# EAGLE design 001-top (EAGLE 9.6.2)

## Sheet 1 of 2
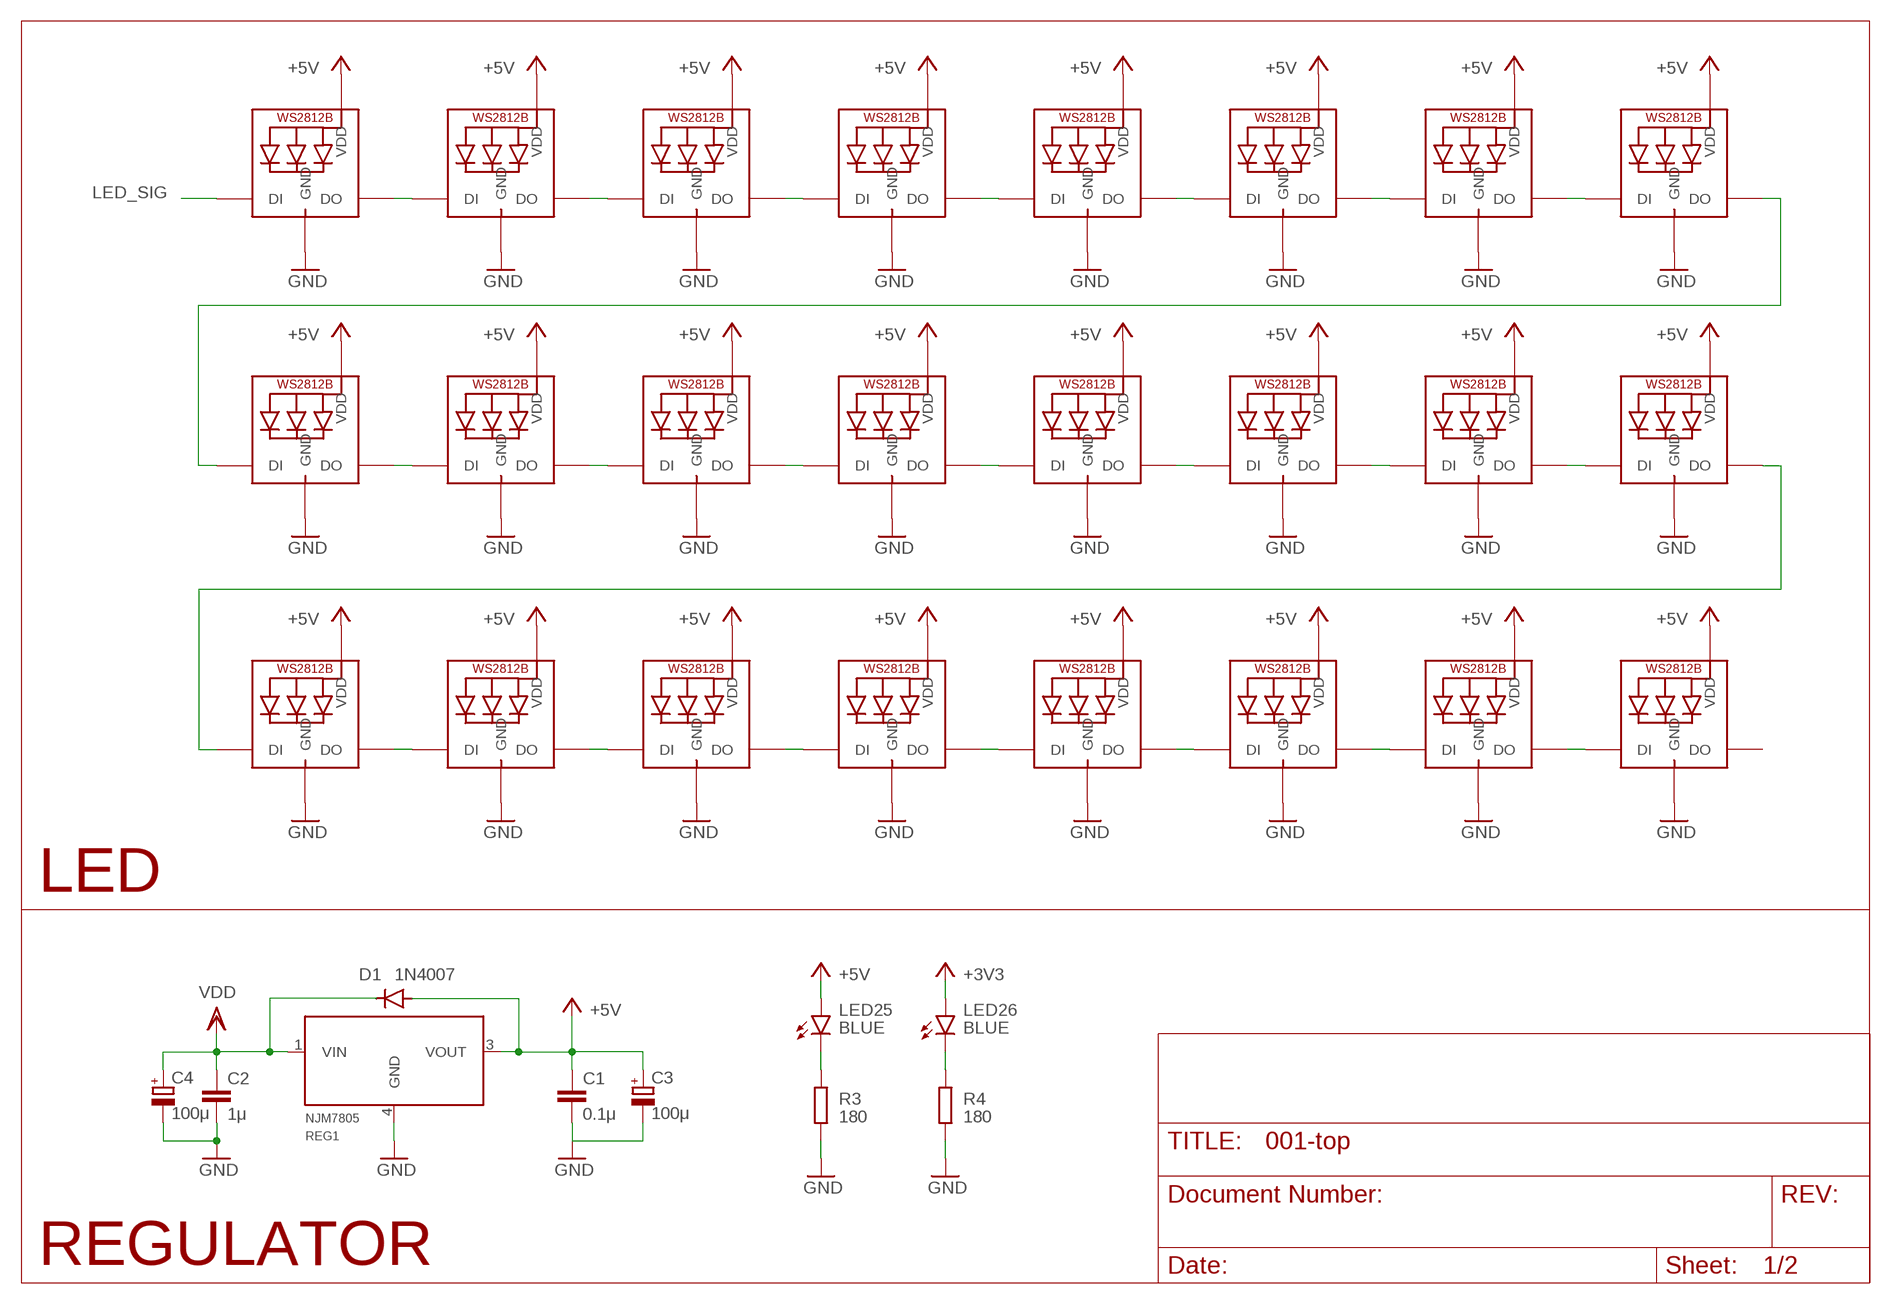
[diagram p0: schematic, sheet 1]

### Parts
C1  0.1μ  C-EUC0402  [C0402]
C2  1μ  C-EUC0402  [C0402]
C3  100μ  CPOL-EU153CLV-0505  [153CLV-0505]
C4  100μ  CPOL-EU153CLV-0505  [153CLV-0505]
D1  1N4007  GF1  [SMA-DO214AC]
LED1  WS2812B_5050N  [WS2812B-NARROW]
LED2  WS2812B_5050N  [WS2812B-NARROW]
LED3  WS2812B_5050N  [WS2812B-NARROW]
LED4  WS2812B_5050N  [WS2812B-NARROW]
LED5  WS2812B_5050N  [WS2812B-NARROW]
LED6  WS2812B_5050N  [WS2812B-NARROW]
LED7  WS2812B_5050N  [WS2812B-NARROW]
LED8  WS2812B_5050N  [WS2812B-NARROW]
LED9  WS2812B_5050N  [WS2812B-NARROW]
LED10  WS2812B_5050N  [WS2812B-NARROW]
LED11  WS2812B_5050N  [WS2812B-NARROW]
LED12  WS2812B_5050N  [WS2812B-NARROW]
LED13  WS2812B_5050N  [WS2812B-NARROW]
LED14  WS2812B_5050N  [WS2812B-NARROW]
LED15  WS2812B_5050N  [WS2812B-NARROW]
LED16  WS2812B_5050N  [WS2812B-NARROW]
LED17  WS2812B_5050N  [WS2812B-NARROW]
LED18  WS2812B_5050N  [WS2812B-NARROW]
LED19  WS2812B_5050N  [WS2812B-NARROW]
LED20  WS2812B_5050N  [WS2812B-NARROW]
LED21  WS2812B_5050N  [WS2812B-NARROW]
LED22  WS2812B_5050N  [WS2812B-NARROW]
LED23  WS2812B_5050N  [WS2812B-NARROW]
LED24  WS2812B_5050N  [WS2812B-NARROW]
LED25  BLUE  LEDSML0603  [SML0603]
LED26  BLUE  LEDSML0603  [SML0603]
R3  180  R-EU_R0402  [R0402]
R4  180  R-EU_R0402  [R0402]
REG1  NJM7805  MYPARTS_NJM7800S-REGULATOR  [MYPARTS_D-PAK_TO252AA]

### Nets
+3V3 [PWR]: LED26.A ; also sheet 2
+5V [PWR]: C1.1 C3.+ D1.A LED1.1-VDD(VDD) LED2.1-VDD(VDD) LED3.1-VDD(VDD) LED4.1-VDD(VDD) LED5.1-VDD(VDD) LED6.1-VDD(VDD) LED7.1-VDD(VDD) LED8.1-VDD(VDD) LED9.1-VDD(VDD) LED10.1-VDD(VDD) LED11.1-VDD(VDD) LED12.1-VDD(VDD) LED13.1-VDD(VDD) LED14.1-VDD(VDD) LED15.1-VDD(VDD) LED16.1-VDD(VDD) LED17.1-VDD(VDD) LED18.1-VDD(VDD) LED19.1-VDD(VDD) LED20.1-VDD(VDD) LED21.1-VDD(VDD) LED22.1-VDD(VDD) LED23.1-VDD(VDD) LED24.1-VDD(VDD) LED25.A REG1.3(VOUT) ; also sheet 2
GND [PWR]: C1.2 C2.2 C3.- C4.- LED1.3-GND(GND) LED2.3-GND(GND) LED3.3-GND(GND) LED4.3-GND(GND) LED5.3-GND(GND) LED6.3-GND(GND) LED7.3-GND(GND) LED8.3-GND(GND) LED9.3-GND(GND) LED10.3-GND(GND) LED11.3-GND(GND) LED12.3-GND(GND) LED13.3-GND(GND) LED14.3-GND(GND) LED15.3-GND(GND) LED16.3-GND(GND) LED17.3-GND(GND) LED18.3-GND(GND) LED19.3-GND(GND) LED20.3-GND(GND) LED21.3-GND(GND) LED22.3-GND(GND) LED23.3-GND(GND) LED24.3-GND(GND) R3.2 R4.2 REG1.4(GND) ; also sheet 2
LED_SIG: LED1.4-DIN(DI) ; also sheet 2
LED_SIGNAL1: LED8.2-DOUT(DO) LED9.4-DIN(DI)
N$1: LED1.2-DOUT(DO) LED2.4-DIN(DI)
N$2: LED2.2-DOUT(DO) LED3.4-DIN(DI)
N$3: LED3.2-DOUT(DO) LED4.4-DIN(DI)
N$4: LED4.2-DOUT(DO) LED5.4-DIN(DI)
N$5: LED5.2-DOUT(DO) LED6.4-DIN(DI)
N$6: LED6.2-DOUT(DO) LED7.4-DIN(DI)
N$7: LED7.2-DOUT(DO) LED8.4-DIN(DI)
N$8: LED9.2-DOUT(DO) LED10.4-DIN(DI)
N$9: LED10.2-DOUT(DO) LED11.4-DIN(DI)
N$10: LED11.2-DOUT(DO) LED12.4-DIN(DI)
N$11: LED12.2-DOUT(DO) LED13.4-DIN(DI)
N$12: LED13.2-DOUT(DO) LED14.4-DIN(DI)
N$13: LED14.2-DOUT(DO) LED15.4-DIN(DI)
N$14: LED15.2-DOUT(DO) LED16.4-DIN(DI)
N$15: LED17.2-DOUT(DO) LED18.4-DIN(DI)
N$16: LED18.2-DOUT(DO) LED19.4-DIN(DI)
N$17: LED19.2-DOUT(DO) LED20.4-DIN(DI)
N$18: LED20.2-DOUT(DO) LED21.4-DIN(DI)
N$19: LED21.2-DOUT(DO) LED22.4-DIN(DI)
N$20: LED22.2-DOUT(DO) LED23.4-DIN(DI)
N$21: LED23.2-DOUT(DO) LED24.4-DIN(DI)
N$22: LED16.2-DOUT(DO) LED17.4-DIN(DI)
N$23: LED25.C R3.1
N$24: LED26.C R4.1
VDD [PWR]: C2.1 C4.+ D1.K(C) REG1.1(VIN) ; also sheet 2
Unconnected: LED24.2-DOUT(DO)

### Notes on the sheet
- LED
- REGULATOR

## Sheet 2 of 2
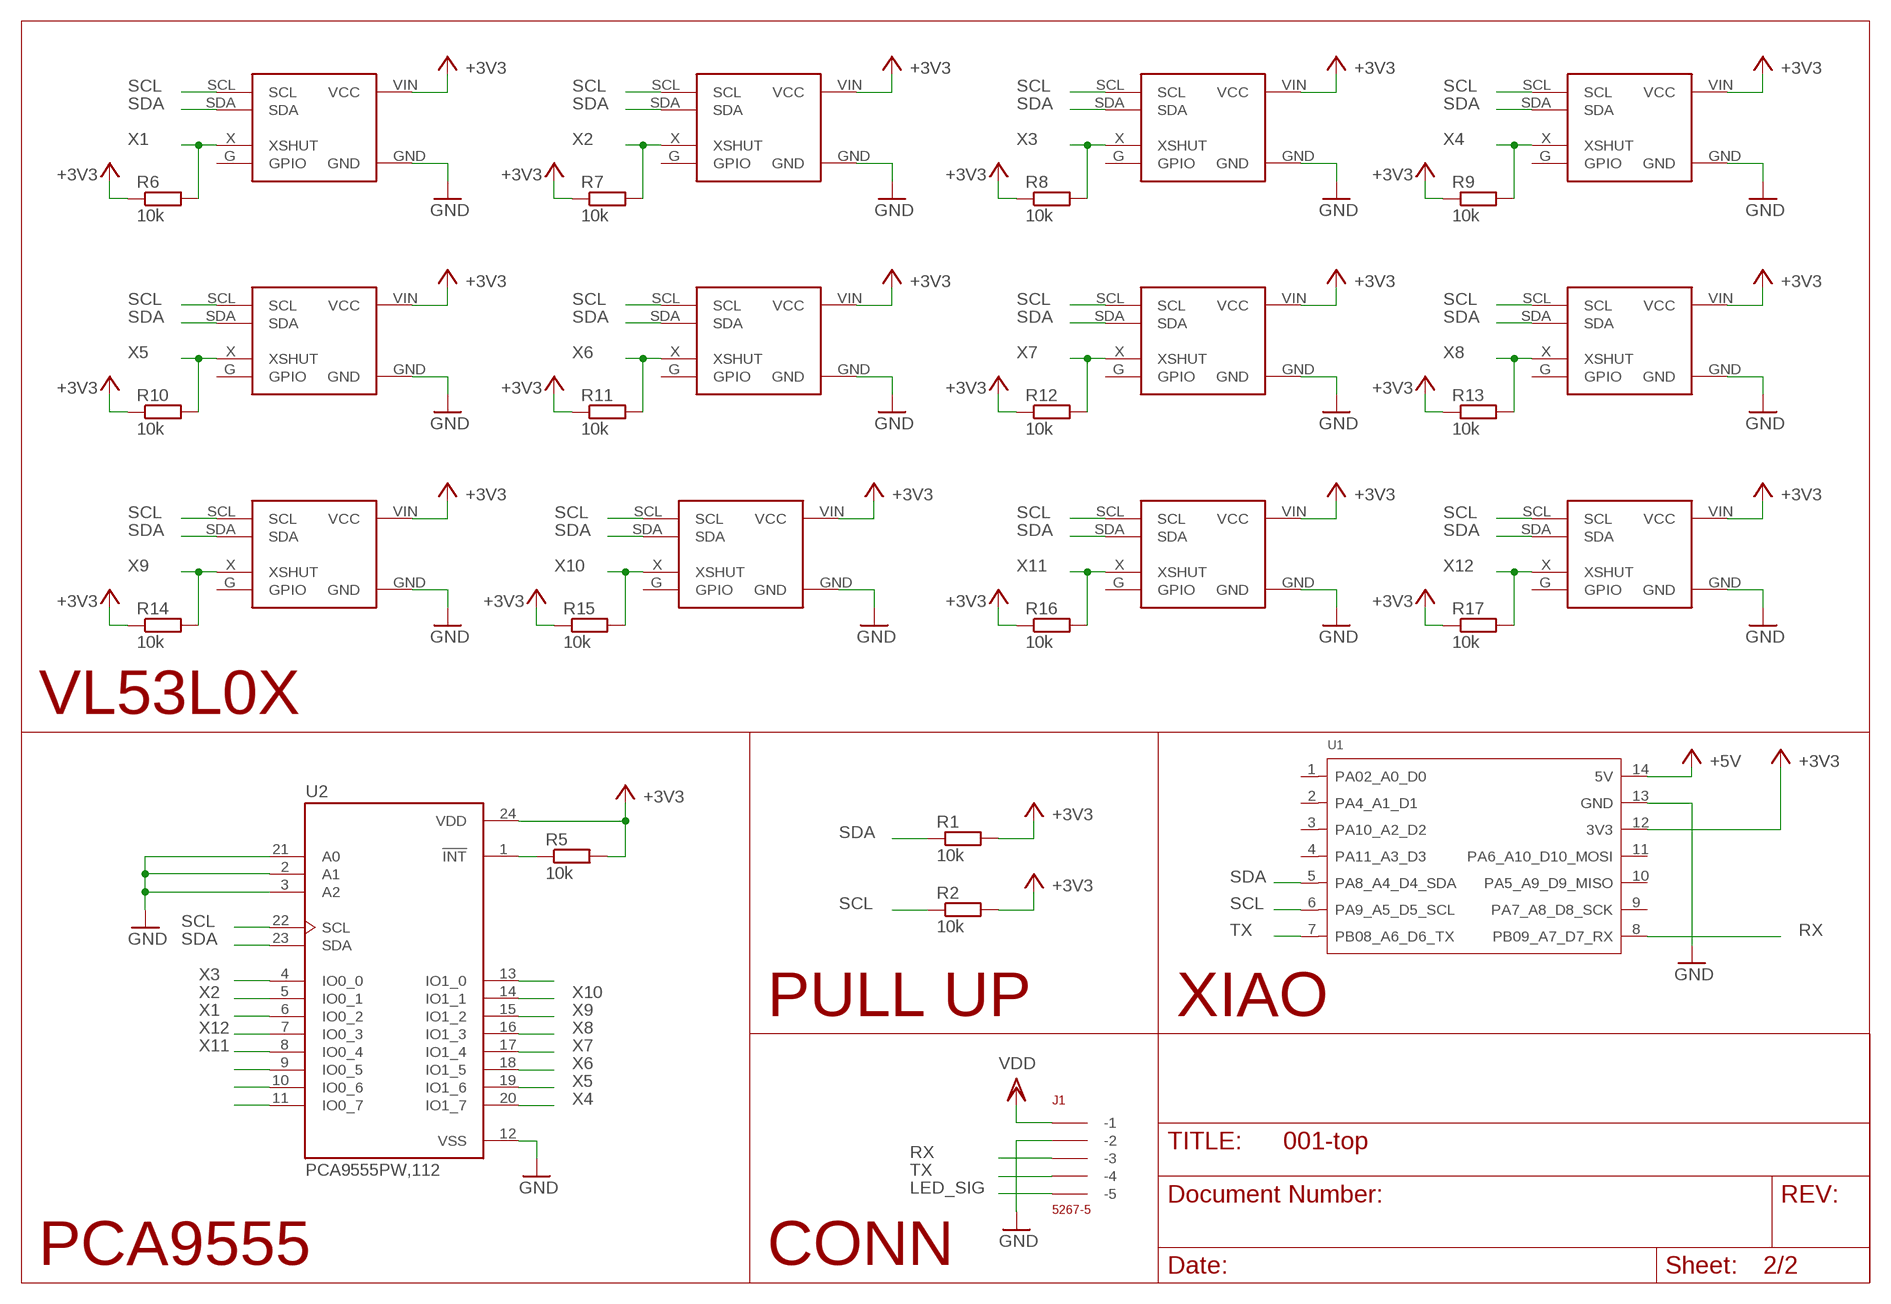
[diagram p1: schematic, sheet 2]

### Parts
J1  5267-5  [5267-5]
R1  10k  R-EU_R0402  [R0402]
R2  10k  R-EU_R0402  [R0402]
R5  10k  R-EU_R0402  [R0402]
R6  10k  R-EU_R0402  [R0402]
R7  10k  R-EU_R0402  [R0402]
R8  10k  R-EU_R0402  [R0402]
R9  10k  R-EU_R0402  [R0402]
R10  10k  R-EU_R0402  [R0402]
R11  10k  R-EU_R0402  [R0402]
R12  10k  R-EU_R0402  [R0402]
R13  10k  R-EU_R0402  [R0402]
R14  10k  R-EU_R0402  [R0402]
R15  10k  R-EU_R0402  [R0402]
R16  10k  R-EU_R0402  [R0402]
R17  10k  R-EU_R0402  [R0402]
U1  MOUDLE-SEEEDUINO-XIAO  [MOUDLE14P-2.54-21X17.8MM]
U2  PCA9555PW,112  [SOP65P640X110-24N]
VL1  VL53L0X  [1X04]
VL2  VL53L0X  [1X04]
VL3  VL53L0X  [1X04]
VL4  VL53L0X  [1X04]
VL5  VL53L0X  [1X04]
VL6  VL53L0X  [1X04]
VL7  VL53L0X  [1X04]
VL8  VL53L0X  [1X04]
VL9  VL53L0X  [1X04]
VL10  VL53L0X  [1X04]
VL11  VL53L0X  [1X04]
VL12  VL53L0X  [1X04]

### Nets
+3V3 [PWR]: R1.2 R2.2 R5.2 R6.1 R7.1 R8.1 R9.1 R10.1 R11.1 R12.1 R13.1 R14.1 R15.1 R16.1 R17.1 U1.12(3V3) U2.24(VDD) VL1.VIN(VCC) VL2.VIN(VCC) VL3.VIN(VCC) VL4.VIN(VCC) VL5.VIN(VCC) VL6.VIN(VCC) VL7.VIN(VCC) VL8.VIN(VCC) VL9.VIN(VCC) VL10.VIN(VCC) VL11.VIN(VCC) VL12.VIN(VCC) ; also sheet 1
+5V [PWR]: U1.14(5V) ; also sheet 1
GND [PWR]: J1.P$2(-2) U1.13(GND) U2.2(A1) U2.3(A2) U2.12(VSS) U2.21(A0) VL1.GND VL2.GND VL3.GND VL4.GND VL5.GND VL6.GND VL7.GND VL8.GND VL9.GND VL10.GND VL11.GND VL12.GND ; also sheet 1
LED_SIG: J1.P$5(-5) ; also sheet 1
N$25: R5.1 U2.1(!INT)
N$39: U2.9(IO0_5)
N$40: U2.10(IO0_6)
N$41: U2.11(IO0_7)
RX: J1.P$3(-3) U1.8(PB09_A7_D7_RX)
SCL: R2.1 U1.6(PA9_A5_D5_SCL) U2.22(SCL) VL1.SCL VL2.SCL VL3.SCL VL4.SCL VL5.SCL VL6.SCL VL7.SCL VL8.SCL VL9.SCL VL10.SCL VL11.SCL VL12.SCL
SDA: R1.1 U1.5(PA8_A4_D4_SDA) U2.23(SDA) VL1.SDA VL2.SDA VL3.SDA VL4.SDA VL5.SDA VL6.SDA VL7.SDA VL8.SDA VL9.SDA VL10.SDA VL11.SDA VL12.SDA
TX: J1.P$4(-4) U1.7(PB08_A6_D6_TX)
VDD [PWR]: J1.P$1(-1) ; also sheet 1
X1 [XSHUT]: R6.2 U2.6(IO0_2) VL1.X(XSHUT)
X2 [XSHUT]: R7.2 U2.5(IO0_1) VL2.X(XSHUT)
X3 [XSHUT]: R8.2 U2.4(IO0_0) VL3.X(XSHUT)
X4 [XSHUT]: R9.2 U2.20(IO1_7) VL4.X(XSHUT)
X4\: U2.13(IO1_0)
X5 [XSHUT]: R10.2 U2.19(IO1_6) VL5.X(XSHUT)
X6 [XSHUT]: R11.2 U2.18(IO1_5) VL6.X(XSHUT)
X7 [XSHUT]: R12.2 U2.17(IO1_4) VL7.X(XSHUT)
X8 [XSHUT]: R13.2 U2.16(IO1_3) VL8.X(XSHUT)
X9 [XSHUT]: R14.2 U2.15(IO1_2) VL9.X(XSHUT)
X10 [XSHUT]: R15.2 U2.14(IO1_1) VL10.X(XSHUT)
X11 [XSHUT]: R16.2 U2.8(IO0_4) VL11.X(XSHUT)
X12 [XSHUT]: R17.2 U2.7(IO0_3) VL12.X(XSHUT)
Unconnected: U1.1(PA02_A0_D0) U1.2(PA4_A1_D1) U1.3(PA10_A2_D2) U1.4(PA11_A3_D3) U1.9(PA7_A8_D8_SCK) U1.10(PA5_A9_D9_MISO) U1.11(PA6_A10_D10_MOSI) VL1.G(GPIO) VL2.G(GPIO) VL3.G(GPIO) VL4.G(GPIO) VL5.G(GPIO) VL6.G(GPIO) VL7.G(GPIO) VL8.G(GPIO) VL9.G(GPIO) VL10.G(GPIO) VL11.G(GPIO) VL12.G(GPIO)

### Notes on the sheet
- VL53L0X
- PULL UP | XIAO
- PCA9555 | CONN

## Library data of the parts
C1 C2 = rcl:C-EU: CAPACITOR, European symbol; SPICEPREFIX: C
C3 C4 = rcl:CPOL-EU: POLARIZED CAPACITOR, European symbol; SPICEPREFIX: C
D1 = diode:GF1: DIODE
J1 = con-molex-spox:5267-5
LED1-LED24 = microbuilder:WS2812B
LED25 LED26 = led:LED: LED OSRAM: - CHIPLED LG R971, LG N971, LY N971, LG Q971, LY Q971, LO R971, LY R971 LH N974, LH R974 LS Q976, LO Q976, LY Q976 LO Q996 - Hyper CHIPLED LW Q18S LB Q993, LB Q99A, LB R99A - SideLED LS A670, LO A670, LY A670, LG A670, LP A670 LB A673, LV A673, LT A673, LW A673 LH A674 LY A675 LS A676, LA A676, LO A676, LY A676, LW A676 LS A679, LY A679, LG A679 - Hyper Micro SIDELED® LS Y876, LA Y876, LO Y876, LY Y876 LT Y87S - SmartLED LW L88C, LW L88S LB L89C, LB L89S, LG L890 LS L89K, LO L89K, LY L89K LS L896, LA L896, LO L896, LY L896 - TOPLED LS T670, LO T670, LY T670, LG T670, LP T670 LSG T670, LSP T670, LSY T670, LOP T670, LYG T670 LG T671, LOG T671, LSG T671 LB T673, LV T673, LT T673, LW T673 LH T674 LS T676, LA T676, LO T676, LY T676, LB T676, LH T676, LSB T676, LW T676 LB T67C, LV T67C, LT T67C, LS T67K, LO T67K, LY T67K, LW E67C LS E67B, LA E67B, LO E67B, LY E67B, LB E67C, LV E67C, LT E67C LW T67C LS T679, LY T679, LG T679 LS T770, LO T770, LY T770, LG T770, LP T770 LB T773, LV T773, LT T773, LW T773 LH T774 LS E675, LA E675, LY E675, LS T675 LS T776, LA T776, LO T776, LY T776, LB T776 LHGB T686 LT T68C, LB T68C - Hyper Mini TOPLED® LB M676 - Mini TOPLED Santana® LG M470 LS M47K, LO M47K, LY M47K Source: http://www.osram.convergy.de LUXEON: - LUMILED® LXK2-PW12-R00, LXK2-PW12-S00, LXK2-PW14-U00, LXK2-PW14-V00 LXK2-PM12-R00, LXK2-PM12-S00, LXK2-PM14-U00 LXK2-PE12-Q00, LXK2-PE12-R00, LXK2-PE12-S00, LXK2-PE14-T00, LXK2-PE14-U00 LXK2-PB12-K00, LXK2-PB12-L00, LXK2-PB12-M00, LXK2-PB14-N00, LXK2-PB14-P00, LXK2-PB14-Q00 LXK2-PR12-L00, LXK2-PR12-M00, LXK2-PR14-Q00, LXK2-PR14-R00 LXK2-PD12-Q00, LXK2-PD12-R00, LXK2-PD12-S00 LXK2-PH12-R00, LXK2-PH12-S00 LXK2-PL12-P00, LXK2-PL12-Q00, LXK2-PL12-R00 Source: www.luxeon.com KINGBRIGHT: KA-3528ASYC Source: www.kingbright.com
R1-R17 = rcl:R-EU_: RESISTOR, European symbol; SPICEPREFIX: R
REG1 = #001-line:MYPARTS_NJM7800S-REGULATOR
U1 = Seeeduino XIAO:MOUDLE-SEEEDUINO-XIAO
U2 = PCA9555PW_112:PCA9555PW,112: Check availability <https://pricing.snapeda.com/parts/PCA9555PW%2C112/NXP%20Semiconductors/view-part?ref=eda>; AVAILABILITY: In Stock; DESCRIPTION: Interface IC - I/O extensions NXP Semiconductors PCA9555PW, 112 POR I²C, SMBus 400 kHz TSSOP 24; MF: NXP Semiconductors; MP: PCA9555PW,112; PACKAGE: TSSOP-24 NXP Semiconductors; PRICE: None; PURCHASE-URL: https://pricing.snapeda.com/search/part/PCA9555PW,112/?ref=eda
VL1-VL12 = VL53L0X:VL53L0X

## Net classes
0 default: width 0.381 mm
1 PWR: width 0.508 mm
2 XSHUT: width 0.254 mm

## Board
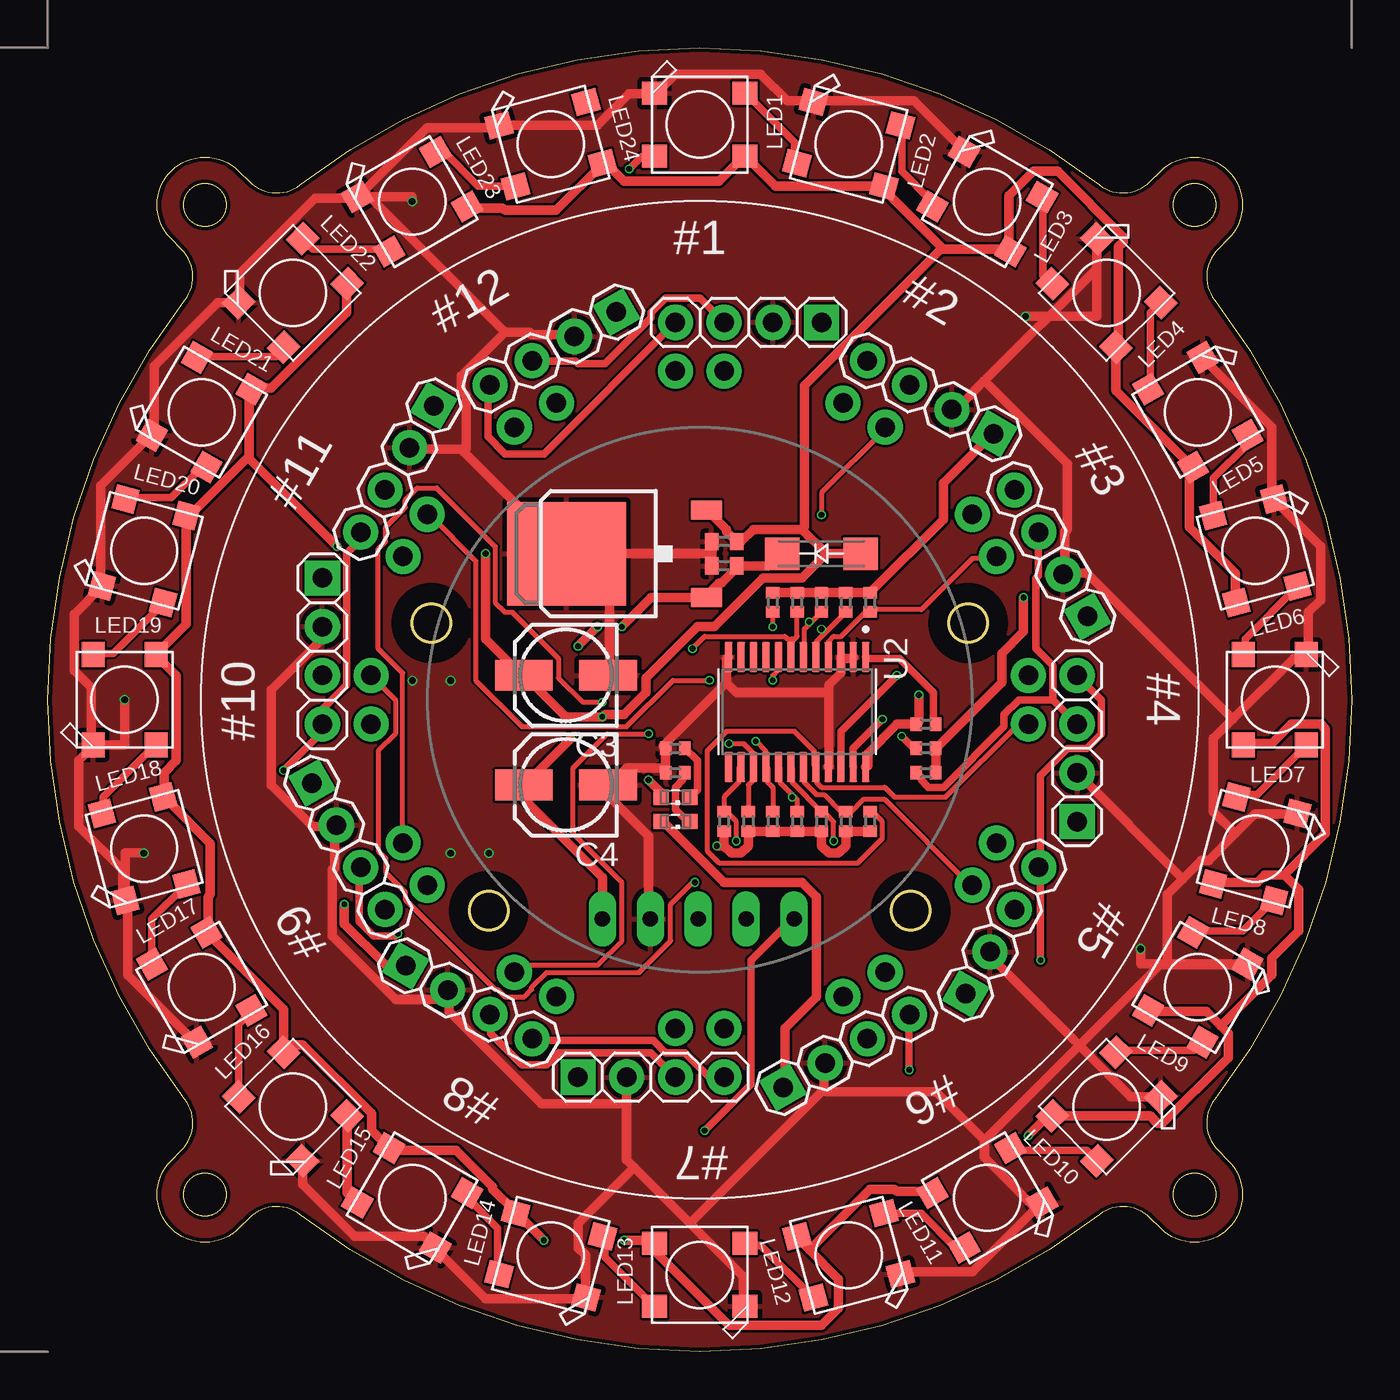
[diagram p2: board, top side]
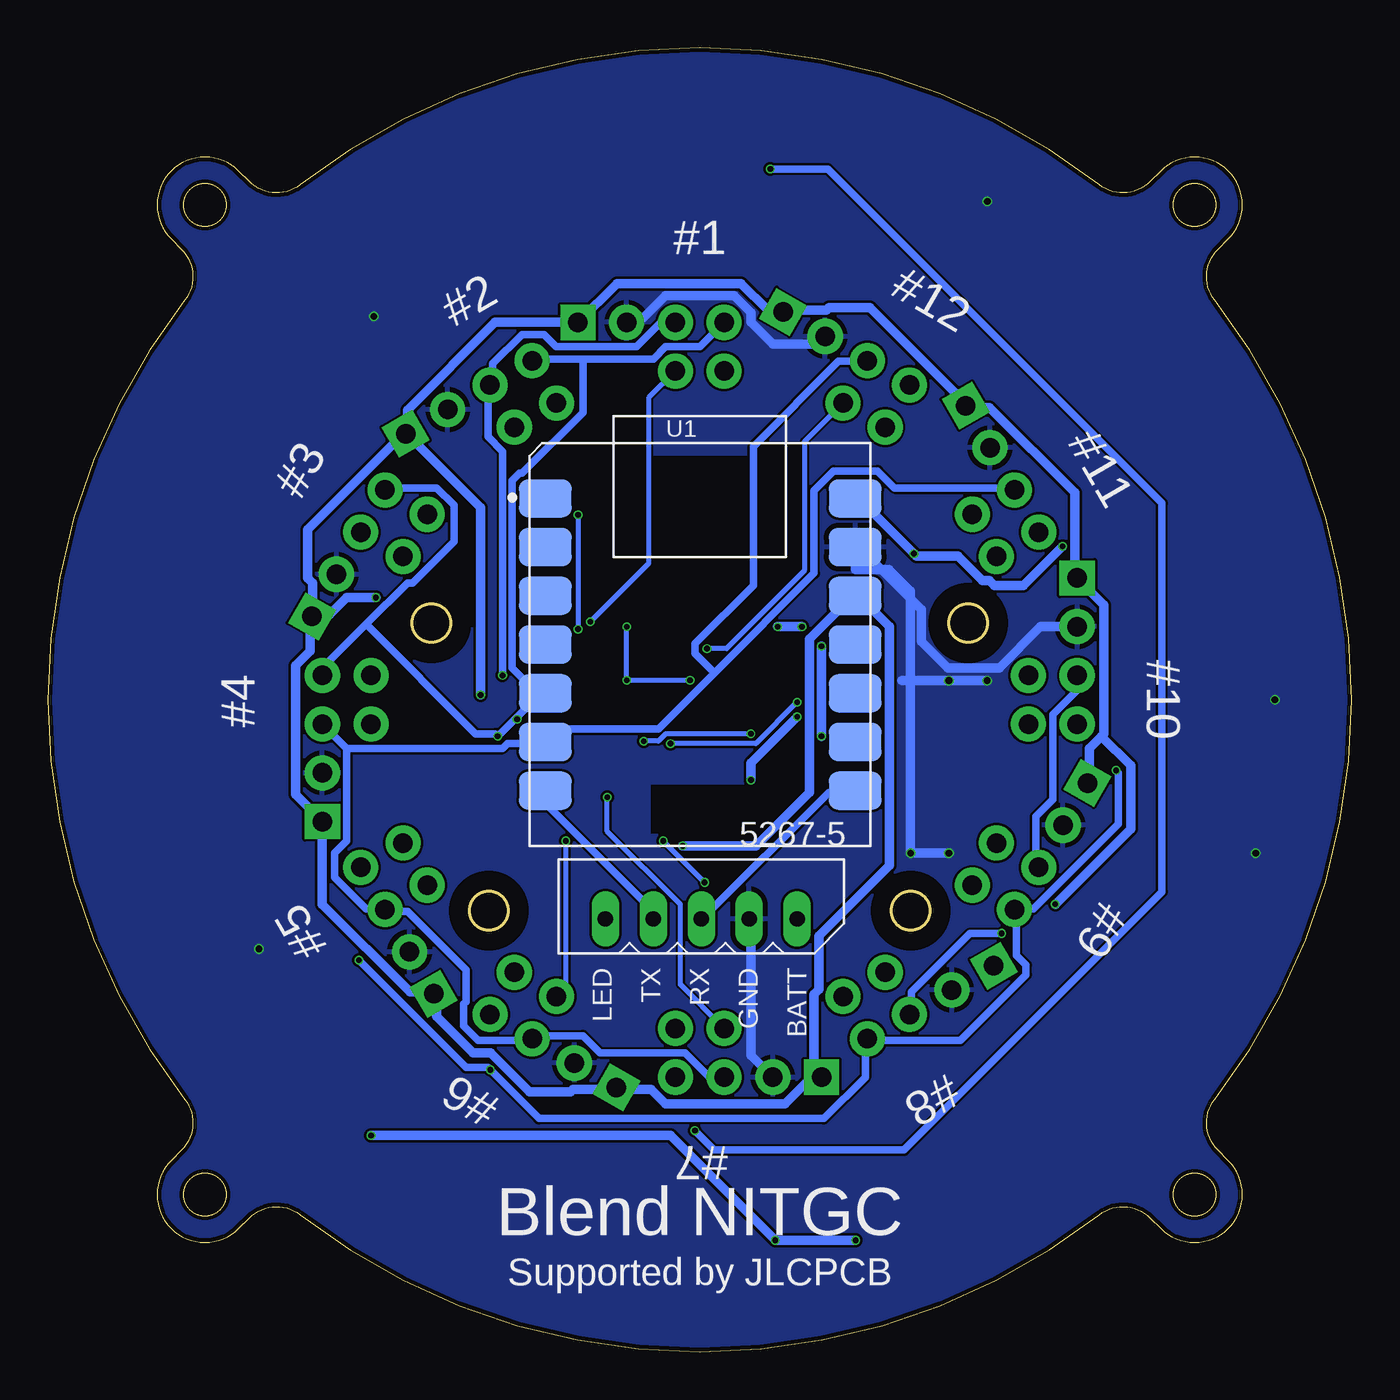
[diagram p3: board, bottom side, seen from below]

Size 68 x 68 mm. Coordinates in mm from the lower left corner, seen from the top.
Outline: 60.86,13.15 arc83 61.02,10.51 61.58,9.96 arc-180 58.04,6.42 57.49,6.98 arc83 54.85,7.14 arc-76 13.15,7.14 arc83 10.51,6.98 9.96,6.42 arc-180 6.42,9.96 6.98,10.51 arc83 7.14,13.15 arc-76 7.14,54.85 arc83 6.98,57.49 6.42,58.04 arc-180 9.96,61.58 10.51,61.02 arc83 13.15,60.86 arc-76 54.85,60.86 arc83 57.49,61.02 58.04,61.58 arc-180 61.58,58.04 61.02,57.49 arc83 60.86,54.85 arc-76 60.86,13.15
Outline: circle at 59.81,8.19 radius 1.1
Outline: circle at 59.81,59.81 radius 1.1
Outline: circle at 8.19,8.19 radius 1.1
Outline: circle at 8.19,59.81 radius 1.1
Outline: circle at 48,38 radius 1
Outline: circle at 45,23 radius 1
Outline: circle at 23,23 radius 1
Outline: circle at 20,38 radius 1
Copper layers (1*16): Top 0.035mm / dielectric 1.6mm / Bottom 0.035mm
Design rules "jlcpcb-2layers": minimum track width 5mil, minimum drill 0.3mm, track to track 5mil, track to pad 5mil, pad to pad 5mil, via to via 5mil, smd to smd 5mil, copper to edge 0.2mm, drill to drill 6mil, minimum pad ring 10mil, minimum via ring 3mil, stop-mask expansion 4mil, vias tented up to drill 0mil, thermal gap 10mil
tRestrict: area 43,21 to 47,25; area 21,21 to 25,25; area 46,36 to 50,40; area 18,36 to 22,40
bRestrict: area 21,21 to 25,25; area 43,21 to 47,25; area 46,36 to 50,40; area 18,36 to 22,40

### Footprints (pad centres in the part's own frame; a part is rotated, then mirrored left to right if it is on the bottom)
C0402 = smd 0.7 x 0.9: 1 -0.65,0; 2 0.65,0
153CLV-0505 = smd 3 x 1.6: + 2.2,0; - -2.2,0
SMA-DO214AC = smd 1.8 x 1.7: A -2.05,0; K 2.05,0
5267-5 = drill 0.8 long: P$1 0,0; P$2 2.5,0; P$3 5,0; P$4 7.5,0; P$5 10,0
WS2812B-NARROW = smd 1.3 x 1.2: 1-VDD 2.35,-1.65; 2-DOUT 2.35,1.65; 3-GND -2.35,1.65; 4-DIN -2.35,-1.65
SML0603 = smd 0.8 x 0.8: A 0.75,0; C -0.75,0
R0402 = smd 0.6 x 0.7: 1 -0.5,0; 2 0.5,0
MYPARTS_D-PAK_TO252AA = smd 1 x 1.6: 1 -2.28,-4.8; 3 2.28,-4.8 | smd 5.4 x 6.2: 4 0,2.5
MOUDLE14P-2.54-21X17.8MM = smd 2.75 x 2: 1 0.835,18.12; 2 0.835,15.58; 3 0.835,13.04; 4 0.835,10.5; 5 0.835,7.96; 6 0.835,5.42; 7 0.835,2.88; 8 17,2.88; 9 17,5.42; 10 17,7.96; 11 17,10.5; 12 17,13.04; 13 17,15.58; 14 17,18.12
SOP65P640X110-24N = smd 1.57 x 0.41: 1 -2.87,3.575; 2 -2.87,2.925; 3 -2.87,2.275; 4 -2.87,1.625; 5 -2.87,0.975; 6 -2.87,0.325; 7 -2.87,-0.325; 8 -2.87,-0.975; 9 -2.87,-1.625; 10 -2.87,-2.275; 11 -2.87,-2.925; 12 -2.87,-3.575; 13 2.87,-3.575; 14 2.87,-2.925; 15 2.87,-2.275; 16 2.87,-1.625; 17 2.87,-0.975; 18 2.87,-0.325; 19 2.87,0.325; 20 2.87,0.975; 21 2.87,1.625; 22 2.87,2.275; 23 2.87,2.925; 24 2.87,3.575
1X04 = drill 1.016: G -1.27,-2.54; GND 3.81,0; SCL 1.27,0; SDA -1.27,0; X 1.27,-2.54 | drill 1.016 square: VIN 6.35,0

### Placement (x,y rotation side)
C1  35.27,42.26 180 top
C2  35.27,40.99 180 top
C3  27.02,35.27 180 top
C4  27.02,29.56 180 top
D1  40.35,41.62 180 top
J1  28.92,22.57 180 bottom
LED1  34,64 0 top
LED2  41.76,62.98 345 top
LED3  49,59.98 330 top
LED4  55.21,55.21 315 top
LED5  59.98,49 300 top
LED6  62.98,41.76 285 top
LED7  64,34 270 top
LED8  62.98,26.24 255 top
LED9  59.98,19 240 top
LED10  55.21,12.79 225 top
LED11  49,8.02 210 top
LED12  41.76,5.02 195 top
LED13  34,4 180 top
LED14  26.24,5.02 165 top
LED15  19,8.02 150 top
LED16  12.79,12.79 135 top
LED17  8.02,19 120 top
LED18  5.02,26.24 105 top
LED19  4,34 90 top
LED20  5.02,41.76 75 top
LED21  8.02,49 60 top
LED22  12.79,55.21 45 top
LED23  19,59.98 30 top
LED24  26.24,62.98 15 top
LED25  32.73,28.92 180 top
LED26  32.73,27.65 180 top
R1  45.8,31.46 0 top
R2  45.8,30.19 0 top
R3  32.73,31.46 180 top
R4  32.73,30.19 180 top
R5  45.8,32.73 180 top
R6  40.35,39.08 270 top
R7  41.62,39.08 270 top
R8  42.89,39.08 270 top
R9  42.89,27.65 90 top
R10  41.62,27.65 90 top
R11  40.35,27.65 90 top
R12  39.08,27.65 90 top
R13  37.81,27.65 90 top
R14  36.54,27.65 90 top
R15  35.27,27.65 90 top
R16  37.81,39.08 270 top
R17  39.08,39.08 270 top
REG1  29.56,41.62 90 top
U1  42.89,26.38 0 bottom
U2  39.08,33.37 270 top
VL1  34,53.69 0 top
VL2  43.84,51.05 330 top
VL3  51.05,43.84 300 top
VL4  53.69,34 270 top
VL5  51.05,24.16 240 top
VL6  43.84,16.95 210 top
VL7  34,14.32 180 top
VL8  24.16,16.95 150 top
VL9  16.95,24.16 120 top
VL10  14.32,34 90 top
VL11  16.95,43.84 60 top
VL12  24.16,51.05 30 top

### Tracks (layer width: path | path; a pad name or v marks a point on that pad's centre or on a via)
+3V3  (via drill 0.3)
  Top 0.508: v15.46,23.33 15.46,22.32 17.62,20.16 18.63,20.16 VL8.VIN | LED26.A 32.1,27.65 35.27,24.48 39.33,24.48 40.1,23.71 40.1,18.51 38.45,16.86 38.45,13.81 VL6.VIN | R9.1 R10.1 41.62,26.38 41.24,26 40.73,26 40.35,26.38 R11.1 39.21,27.14 R12.1 37.94,27.14 R13.1 36.67,27.14 R14.1 36.54,26.38 36.16,26 35.65,26 35.27,26.38 | 35.27,26.38 R15.1 | v34.89,26.38 35.27,26.38 | R2.2 46.32,30.19 46.32,31.46 R1.2 46.45,31.59 49.75,34.89 49.75,36.41 50.89,37.56 v50.89,39.33 | U2.24 42.76,30.57 42.76,31.21 44.29,32.73 R5.2 45.43,32.86 v45.43,34.25 | R16.1 R17.1 39.21,39.59 R6.1 40.48,39.59 R7.1 41.75,39.59 R8.1 43.02,39.72 46.7,43.4 46.7,45.3 49.24,47.84 VL2.VIN
  Bottom 0.508: 13.05,32.1 12.92,32.22 12.92,38.95 VL10.VIN 14.44,40.48 14.44,44.8 18.89,49.24 20.03,49.24 VL11.VIN 20.16,49.49 25.11,54.45 27.27,54.45 27.4,54.32 29.56,54.32 VL12.VIN 29.81,54.32 30.44,54.32 31.84,55.72 38.32,55.72 VL1.VIN 44.67,53.69 49.24,49.11 49.24,48.1 VL2.VIN | 13.05,32.1 13.68,31.46 13.68,29.68 VL9.VIN | v15.46,23.33 11.52,27.27 11.52,30.57 13.05,32.1 | v34.89,26.38 31.08,26.38 28.29,29.17 28.29,37.18 26.13,39.33 U1.12 25.87,39.33 25.62,39.33 24.09,37.81 24.09,25.36 27.78,21.68 27.78,18.89 28.03,18.63 28.03,14.7 VL7.VIN 28.03,14.44 29.56,12.92 35.78,12.92 36.54,13.68 38.32,13.68 VL6.VIN 38.57,13.68 40.6,13.68 40.73,13.55 42.89,13.55 44.92,15.59 45.81,15.59 47.72,17.49 47.72,18.51 VL5.VIN 47.97,18.76 49.11,18.76 53.69,23.33 VL4.VIN 55.08,29.05 55.08,35.78 54.32,36.54 54.32,38.19 VL3.VIN | v50.89,39.33 52.42,39.33 53.3,38.45 54.19,38.45 VL3.VIN | v45.43,34.25 45.43,44.03 49.24,47.84 VL2.VIN | VL3.VIN 54.19,38.7 54.19,40.1 54.45,40.35 54.45,42.89 49.49,47.84 VL2.VIN
+5V  (via drill 0.3)
  Top 0.508: REG1.3 34.38,43.91 35.4,42.89 35.4,42.76 35.91,42.26 C1.1 36.16,42.26 36.79,42.89 39.33,42.89 | 40.6,41.62 D1.A | 39.33,42.89 40.6,41.62 | v31.33,29.81 31.97,29.17 31.97,28.92 LED25.A | v22.82,41.62 22.82,37.18 24.6,35.4 C3.+ 24.86,35.27 27.02,33.11 v28.92,33.11 29.05,33.24 30.06,33.24 31.21,34.38 31.21,35.14 33.87,37.81 34.76,37.81 37.3,40.35 39.33,40.35 40.6,41.62 | LED6.1-VDD 61.94,39.08 61.94,40.6 59.53,43.02 59.53,46.07 LED5.1-VDD 59.65,46.19 55.72,50.13 55.72,52.29 LED4.1-VDD 55.84,52.54 55.84,57.62 56.1,57.88 56.1,58.13 52.67,61.56 51.4,61.56 50.13,60.29 50.13,57.75 LED3.1-VDD 50.13,57.5 46.7,57.5 | LED23.1-VDD 21.94,59.65 23.71,59.65 23.84,59.53 26.51,59.53 28.92,61.94 LED24.1-VDD 29.17,61.94 30.06,61.05 35.02,61.05 36.16,62.19 LED1.1-VDD 36.41,62.32 37.94,60.8 43.53,60.8 LED2.1-VDD 43.65,60.54 46.7,57.5 | 39.33,42.89 39.46,43.02 39.46,50.38 46.57,57.5 46.7,57.5 | 61.18,16.98 60.42,17.74 57.5,17.74 LED9.1-VDD | 61.18,16.98 61.56,16.6 61.56,15.33 58.13,11.9 57.88,11.9 57.5,12.28 52.42,12.28 LED10.1-VDD 52.16,12.28 v51.15,11.27 | 64.48,24.86 63.46,24.86 63.08,24.48 60.8,24.48 LED8.1-VDD | 64.48,24.86 65.24,24.09 65.24,21.94 63.85,20.54 63.85,19.65 61.18,16.98 | 64.48,24.86 66.64,27.02 66.64,32.48 66.39,32.73 64.86,32.73 63.85,31.71 62.45,31.71 LED7.1-VDD | 39.72,5.3 39.08,5.93 LED12.1-VDD | 39.72,5.3 41.24,3.77 41.24,2.25 40.35,1.36 35.52,1.36 31.71,5.17 31.71,5.55 LED13.1-VDD 31.46,5.81 v30.06,5.81 | 39.72,5.3 42.89,8.47 44.16,8.47 44.29,8.35 46.07,8.35 LED11.1-VDD | 10.51,46.7 10.51,50.13 LED21.1-VDD 10.89,50.26 11.65,50.26 15.59,54.19 15.59,55.59 LED22.1-VDD
  Top 0.508: 10.51,46.7 7.46,43.65 LED20.1-VDD 7.2,43.53 7.2,37.94 5.81,36.54 LED19.1-VDD 5.68,36.29 6.7,35.27 6.7,30.83 6.06,30.19 6.06,29.05 LED18.1-VDD 6.19,28.79 8.47,26.51 8.47,23.84 8.35,23.71 8.35,21.94 LED17.1-VDD 12.29,17.84 12.29,16 | v25.87,5.81 24.6,7.08 LED14.1-VDD 24.35,7.33 23.21,8.47 23.21,8.6 21.3,10.51 18,10.51 LED15.1-VDD 16.88,11.53 16.88,12.41 13.29,16 12.29,16 | v15.08,42 10.51,46.57 10.51,46.7 | LED16.1-VDD 12.29,16
  Bottom 0.508: v31.33,29.81 31.33,30.7 v28.92,33.11 | U1.14 25.87,44.41 25.62,44.41 v22.82,41.62 22.7,41.49 20.54,41.49 19.27,40.22 18.89,40.22 18.63,39.97 17.11,39.97 v15.08,42 | v25.87,5.81 v30.06,5.81 35.52,11.27 v51.15,11.27
GND  (via drill 0.35)
  Top 0.508: 34.64,41.62 34.64,42.26 C1.2 | 34.64,41.62 34.64,40.99 C2.2 | REG1.4 34.64,41.62 | C3.- 29.3,35.27 29.3,41.49 REG1.4 | 21.68,46.95 26.89,41.75 REG1.4 | 21.68,46.95 21.55,47.08 18.89,47.08 VL11.GND | 23.84,53.18 25.11,53.18 25.24,53.05 27.4,53.05 VL12.GND | 23.84,53.18 21.55,50.89 21.55,50.13 21.81,49.88 21.81,47.08 21.68,46.95 | LED3.3-GND 47.72,62.7 45.18,65.24 39.97,65.24 LED2.3-GND 39.72,65.24 38.57,65.24 37.18,66.64 32.73,66.64 31.84,65.75 LED1.3-GND 31.59,65.62 30.32,65.62 28.67,63.97 23.71,63.97 LED24.3-GND 23.46,63.85 19.78,63.85 16.22,60.29 LED23.3-GND | 7.84,16.09 LED17.3-GND 7.58,16.22 4.16,19.65 4.16,23.46 LED18.3-GND | LED19.3-GND 2.25,31.71 2.25,34.64 1.36,35.52 1.36,38.45 2.76,39.84 LED20.3-GND 2.76,40.1 2.76,45.18 5.3,47.72 LED21.3-GND 5.55,47.97 5.55,51.4 8.85,54.7 9.87,54.7 LED22.3-GND 10,54.96 10,56.23 13.93,60.16 15.97,60.16 LED23.3-GND | LED18.3-GND 3.9,23.71 3.9,25.11 1.62,27.4 1.62,30.83 2.25,31.46 LED19.3-GND | 23.84,53.18 16.6,60.42 LED23.3-GND | 40.73,34.38 40.73,34.76 41.37,35.4 41.37,36.16 | 40.73,34.38 40.73,30.57 U2.21 | 41.37,36.16 U2.3 | 41.37,36.16 42,36.16 U2.2 | 35.4,34.89 35.4,36.16 U2.12 | 35.4,34.89 32.1,31.59 R3.2 R4.2 32.1,30.44 30.19,30.44 29.3,29.56 C4.- 29.43,29.43 29.43,28.79 31.33,26.89 31.33,22.57 J1.P$2 | 40.73,34.38 35.91,34.38 35.4,34.89 | 30.57,9.62 30.19,10 30.19,12.92 | 30.57,9.62 33.49,6.7 | 33.49,6.7 36.29,3.9 36.29,2.38 LED13.3-GND | VL7.GND 30.19,12.92 | 30.57,9.62 27.65,6.7 27.65,5.43 28.03,5.04 28.03,2.89 LED14.3-GND 27.9,2.76 22.82,2.76 20.28,5.3 LED15.3-GND 19.63,6 16,6 13.28,8.72 LED16.3-GND
  Top 0.508: 40.48,13.68 40.48,14.95 VL6.GND | 33.49,6.7 40.48,13.68 | 30.19,12.92 25.75,12.92 20.92,17.74 20.92,18.76 VL8.GND 20.79,18.38 18.13,18.38 14.82,21.68 14.82,25.11 14.95,25.24 14.95,27.4 VL9.GND 14.7,27.4 13.81,27.4 11.65,29.56 11.65,34.51 14.32,37.18 VL10.GND | 48.86,50.64 47.46,49.24 47.21,49.24 VL2.GND | 48.86,50.64 54.7,56.48 54.7,58 LED4.3-GND 54.72,54 v51,54 | 48.86,50.64 53.18,46.32 53.18,42.89 53.05,42.76 53.05,40.6 VL3.GND 53.3,40.6 54.19,40.6 61.81,32.98 | LED5.3-GND 60.29,51.78 63.85,48.22 63.85,44.54 LED6.3-GND 64.1,44.29 66.39,42 66.39,39.21 65.75,38.57 65.75,36.41 LED7.3-GND 65.5,36.16 64.99,36.16 61.81,32.98 | LED12.3-GND 44.54,4.16 48.22,4.16 51.78,7.71 LED11.3-GND 51.4,7.58 48.86,10.12 48.86,11.01 | 53.81,15.97 49.24,20.54 49.24,20.79 VL5.GND | 53.81,15.97 56.48,13.3 58,13.3 LED10.3-GND | 58.38,20.16 58,20.16 53.81,15.97 | 58.38,20.16 62.58,20.16 LED9.3-GND 57,20.21 v57,21 | 61.94,27.02 60.54,25.62 60.16,25.62 59.21,24.67 | 61.94,27.02 62.96,28.03 65.12,28.03 LED8.3-GND | 59.21,24.67 58.38,23.84 58.38,20.16 | 59.21,24.67 VL4.GND | 53.81,15.97 48.86,11.01 | 61.81,32.98 60.8,31.97 60.8,28.16 61.94,27.02 | 48.86,11.01 46.32,13.55 40.6,13.55 40.48,13.68 | LED23.3-GND 19,60.24 v19,60 | LED19.3-GND 4,31.65 v4,34 | LED18.3-GND 4.04,26 v5,26 | REG1.4 26.68,42 25,42
  Bottom 0.508: VL1.GND 37.18,53.69 35.78,55.08 32.22,55.08 31.33,54.19 31.33,53.69 30.19,52.54 27.9,52.54 27.52,52.92 VL12.GND | VL10.GND 16.22,37.81 18.38,35.65 21.05,35.65 22.44,37.05 22.44,38.7 25.62,41.87 25.87,41.87 U1.13 25.89,40.8 24.13,40.8 23,39.67 23,35 | VL7.GND 31.33,15.46 31.33,22.57 J1.P$2 | 23.46,35 23,35 | v19.01,35 v21,35 23,35 | 23,35 v23,26 v21,26
  pour Top: 0,68 68,68 68,0 0,0
  pour Bottom: 0,68 68,68 68,0 0,0
LED_SIG  (via drill 0.3)
  Top 0.381: v30.32,61.69 30.95,62.32 31.59,62.32 LED1.4-DIN | v34.25,11.52 36.67,13.93 36.67,20.41 38.83,22.57 J1.P$5
  Bottom 0.381: v30.32,61.69 27.32,61.69 9.89,44.26 9.89,23.98 23.35,10.52 33.25,10.52 v34.25,11.52
LED_SIGNAL1
  Top 0.381: LED9.4-DIN 59.78,21.94 62.32,21.94 63.85,23.46 LED8.2-DOUT
N$1
  Top 0.381: LED2.4-DIN 38.95,62.07 38.95,63.08 36.41,65.62 LED1.2-DOUT
N$2
  Top 0.381: LED2.2-DOUT 44.54,63.85 44.54,61.56 46.07,60.04 46.07,59.78 LED3.4-DIN
N$3
  Top 0.381: LED3.2-DOUT 51.91,60.16 51.91,56.1 52.29,55.72 LED4.4-DIN
N$4
  Top 0.381: LED5.4-DIN 57.5,50.26 57.5,54.19 58,54.7 LED4.2-DOUT
N$5
  Top 0.381: LED6.4-DIN 60.8,43.65 60.8,45.56 62.58,47.34 62.58,47.72 LED5.2-DOUT
N$6
  Top 0.381: LED7.4-DIN 62.45,36.41 62.45,37.18 65.12,39.84 LED6.2-DOUT
N$7
  Top 0.381: LED8.4-DIN 62.07,29.05 63.08,29.05 65.62,31.59 LED7.2-DOUT
N$8
  Top 0.381: LED10.4-DIN 55.72,15.71 59.78,15.71 60.16,16.09 LED9.2-DOUT
N$9
  Top 0.381: LED11.4-DIN 50.26,10.51 54.19,10.51 54.7,10 LED10.2-DOUT
N$10
  Top 0.381: LED12.4-DIN 43.65,7.2 45.56,7.2 47.34,5.43 47.72,5.43 LED11.2-DOUT
N$11
  Top 0.381: LED13.4-DIN 36.41,5.55 37.18,5.55 39.84,2.89 LED12.2-DOUT
N$12
  Top 0.381: LED14.4-DIN 29.05,5.93 29.05,4.92 31.59,2.38 LED13.2-DOUT
N$13
  Top 0.381: LED14.2-DOUT 23.46,4.16 23.46,6.44 21.94,7.97 21.94,8.22 LED15.4-DIN
N$14
  Top 0.508: LED15.2-DOUT 15.62,8.29 LED16.4-DIN
N$15
  Top 0.381: LED17.2-DOUT 5.43,20.28 5.43,22.57 7.2,24.35 LED18.4-DIN
N$16
  Top 0.381: LED18.2-DOUT 2.89,28.16 2.89,28.92 5.55,31.59 LED19.4-DIN
N$17
  Top 0.381: LED19.2-DOUT 2.38,36.41 3.39,36.41 5.93,38.95 LED20.4-DIN
N$18
  Top 0.381: LED20.2-DOUT 4.16,44.54 6.44,44.54 7.97,46.07 8.22,46.07 LED21.4-DIN
N$19
  Top 0.381: LED21.2-DOUT 7.84,51.91 11.9,51.91 12.28,52.29 LED22.4-DIN
N$20
  Top 0.381: LED23.4-DIN 17.74,57.5 13.81,57.5 13.3,58 LED22.2-DOUT
N$21
  Top 0.381: LED24.4-DIN 24.35,60.8 22.44,60.8 20.67,62.58 20.28,62.58 LED23.2-DOUT
N$22
  Top 0.381: LED17.4-DIN 10.63,17.74 9.96,17.07 LED16.2-DOUT
N$23
  Top 0.381: R3.1 33.87,30.83 33.87,29.3 33.49,28.92 LED25.C
N$24
  Top 0.381: R4.1 33.11,30.19 33.11,29.81 32.73,29.43 32.73,28.29 33.37,27.65 LED26.C
N$25
  Top 0.381: R5.1 46.19,32.73 46.19,34.38 44.41,36.16 42.76,36.16 U2.1
RX
  Bottom 0.381: U1.8 26,29.17 27.27,29.17 33.87,22.57 J1.P$3
SCL  (via drill 0.3)
  Top 0.381: VL7.SCL 31.46,15.59 26.63,15.59 26,14.95 24.73,14.95 23.08,16.6 23.08,17.49 VL8.SCL | v18.25,21.81 18.13,21.68 16.98,21.68 16.22,22.44 16.22,25.24 VL9.SCL | VL1.SCL 34,54.96 32.22,54.96 31.46,54.19 31.46,53.94 29.05,51.53 27.65,51.53 27.52,51.65 25.36,51.65 VL12.SCL | v44.29,35.27 41.37,32.35 41.37,30.57 U2.22 | 52.42,34 50.64,34 49.88,33.24 49.88,32.6 46.7,29.43 45.94,29.43 45.56,29.81 45.56,29.94 45.3,30.19 R2.1 | VL4.SCL 52.42,34 | 52.42,34 52.42,35.78 51.53,36.67 51.53,40.35 51.65,40.48 51.65,42.64 VL3.SCL
  Bottom 0.381: VL10.SCL 14.32,34.51 15.59,33.24 15.59,28.79 16.47,27.9 16.47,25.49 16.35,25.36 VL9.SCL | VL7.SCL 33.49,14.32 34.76,15.59 39.21,15.59 40.1,16.47 42.51,16.47 42.64,16.35 VL6.SCL 42.89,16.22 45.56,16.22 46.32,16.98 46.32,18.13 46.19,18.25 46.19,19.9 49.24,22.95 50.26,22.95 VL5.SCL 50.51,23.08 51.4,23.08 53.05,24.73 53.05,26 52.42,26.63 52.42,31.46 | v18.25,21.81 19.9,21.81 22.95,18.76 22.95,17.62 VL8.SCL | v44.29,35.27 44.29,46.95 45.05,47.72 45.05,50.38 VL2.SCL 44.8,50.51 44.8,51.53 43.27,53.05 42.13,53.05 41.49,52.42 37.3,52.42 36.03,53.69 VL1.SCL | 52.42,31.46 44.29,31.46 44.03,31.71 42.13,31.71 U1.6 41.87,31.84 41.24,32.48 36.16,32.48 33.24,35.4 | VL4.SCL 52.42,31.46 | 33.24,35.4 28.03,40.6 28.03,44.92 27.02,45.94 24.73,45.94 23.84,45.05 17.62,45.05 VL11.SCL | 33.24,35.4 34.25,36.41 34.25,36.92 31.21,39.97 31.21,47.21 26.76,51.65 25.36,51.65 VL12.SCL
SDA  (via drill 0.3)
  Top 0.381: VL11.SDA 16.22,42.64 16.22,42.26 15.59,41.62 15.59,34.76 14.32,33.49 VL10.SDA 14.19,32.6 14.19,32.22 v12.28,30.32 | VL7.SDA 34.51,14.32 33.24,15.59 32.22,15.59 31.59,16.22 25.36,16.22 VL8.SDA | v44.92,14.7 44.92,17.49 VL6.SDA | VL1.SDA 25.87,46.83 23.84,46.83 22.95,47.72 22.95,50.38 VL12.SDA | v44.54,32.1 45.18,31.46 R1.1 | v43.53,32.98 42,31.46 42,30.57 U2.23 | VL4.SDA 54.96,34 54.96,32.22 54.19,31.46 53.18,31.46 51.78,30.06 51.78,25.36 VL5.SDA 51.78,25.11 v51.78,20.41
  Bottom 0.381: v12.28,30.32 12.16,30.19 12.16,27.52 16.6,23.08 17.36,23.08 VL9.SDA 17.49,22.95 17.49,20.67 16.98,20.16 16.98,19.65 20.41,16.22 25.24,16.22 VL8.SDA 25.36,16.09 25.36,14.32 27.52,12.16 42.38,12.16 v44.92,14.7 45.05,14.82 46.19,14.82 v51.78,20.41 | 40.1,51.78 36.41,51.78 35.78,52.42 34,52.42 VL1.SDA | 40.1,51.78 42.64,51.78 VL2.SDA | 43.59,33.05 42.38,34.25 42.13,34.25 U1.5 42.51,34.38 43.78,35.65 43.78,45.43 43.4,45.81 43.27,45.81 40.1,48.99 40.1,51.78 | 43.59,33.05 v44.54,32.1 44.67,32.22 45.68,32.22 51.4,37.94 | v43.53,32.98 43.59,33.05 | 51.4,37.94 53.69,35.65 VL4.SDA | 51.4,37.94 49.24,40.1 48.99,40.1 46.83,42.26 46.83,44.16 47.72,45.05 50.38,45.05 VL3.SDA
TX
  Bottom 0.381: U1.7 42,29.17 42,28.54 36.54,23.08 36.54,22.57 J1.P$4
VDD  (via drill 0.3)
  Top 0.508: D1.K 38.19,41.62 37.56,40.99 C2.1 35.91,40.86 35.14,40.1 35.02,40.1 34.38,39.46 REG1.1 34.13,39.33 31.46,39.33 v29.94,37.81 | J1.P$1 28.92,24.73 24.86,28.79 24.86,29.56 C4.+ 24.98,29.68 27.4,32.1 v27.65,32.1 | v27.65,36.79 v28.67,37.81
  Bottom 0.508: v28.67,37.81 v29.94,37.81 | v27.65,32.1 v27.65,36.79
X1  (via drill 0.3)
  Top 0.254: 39.78,38 39.46,37.68 39.46,36.29 U2.6 | 39.78,38 R6.2 | v39.72,38.06 39.78,38
  Bottom 0.254: v39.72,38.06 36.67,41.11 36.67,49.75 VL1.X
X2  (via drill 0.3)
  Top 0.254: 40.54,37.49 40.1,37.05 40.1,36.29 U2.5 | 40.54,37.49 R7.2 | v40.35,37.68 40.54,37.49 | v40.35,43.65 40.35,44.8 43.65,48.1 VL2.X
  Bottom 0.254: v40.35,43.65 v40.35,37.68
X3
  Top 0.254: U2.4 40.73,36.29 40.73,37.05 40.99,37.3 41.37,37.3 42.64,38.57 R8.2 42.89,38.7 45.56,38.7 48.22,41.37 49.37,41.37 VL3.X
X4
  Top 0.254: R9.2 42.89,28.03 43.14,28.03 43.53,27.65 43.53,26.76 42.26,25.49 35.02,25.49 34.38,26.13 34.38,31.33 35.4,32.35 38.95,32.35 39.97,31.33 39.97,30.57 U2.20 40.1,30.44 40.1,29.68 40.35,29.43 43.65,29.43 44.16,28.92 46.83,28.92 50.64,32.73 VL4.X
X5
  Top 0.254: R10.2 41.37,28.16 40.48,29.05 40.1,29.05 39.46,29.68 39.46,30.44 U2.19 | R10.2 41.87,28.16 42.51,28.79 43.65,28.79 48.1,24.35 VL5.X | R10.2
X6  (via drill 0.3)
  Top 0.254: U2.18 38.83,30.44 38.83,29.68 R11.2 40.35,28.03 40.6,28.03 40.99,27.65 v40.99,26.63
  Bottom 0.254: v40.99,26.63 40.99,19.01 41.37,18.63 VL6.X
X7  (via drill 0.3)
  Top 0.254: R12.2 39.08,28.79 38.89,28.98 | 38.89,28.98 38.19,29.68 38.19,30.44 U2.17 | v38.83,28.92 38.89,28.98
  Bottom 0.254: v38.83,28.92 38.83,27.14 35.02,23.33 35.02,19.14 VL7.X
X8  (via drill 0.3)
  Top 0.254: R13.2 37.81,29.43 37.56,29.68 37.56,30.44 U2.16 37.43,30.57 37.43,31.33 v36.92,31.84 | v31.33,32.22 29.17,32.22 27.4,30.44 27.4,27.02 29.94,24.48 29.94,21.43 28.67,20.16 24.6,20.16 24.35,19.9 VL8.X
  Bottom 0.254: v36.92,31.84 36.16,31.84 35.78,32.22 v31.33,32.22
X9  (via drill 0.3)
  Top 0.254: R14.2 36.54,29.56 36.79,29.81 36.79,30.44 U2.15 36.79,30.57 36.79,31.21 36.29,31.71 v35.52,31.71 | v28.92,33.87 27.9,33.87 26.63,35.14 26.63,36.16 24.22,38.57 23.84,38.57 23.33,39.08 23.33,42 20.28,45.05 19.27,45.05 18.63,44.41 18.63,44.03 17.62,43.02 17.62,42.26 17.24,41.87 17.24,36.67 18.51,35.4 18.51,26.63 VL9.X
  Bottom 0.254: v35.52,31.71 31.08,31.71 v28.92,33.87
X10  (via drill 0.3)
  Top 0.254: U2.14 36.03,30.44 36.03,29.68 35.27,28.92 R15.2 35.27,28.03 35.52,28.03 35.91,27.65 v35.91,26.63 | v33.75,24.48 33.62,24.48 32.48,23.33 32.48,21.43 30.83,19.78 26,19.78 25.24,19.01 25.24,18.89 24.86,18.51 23.84,18.51 23.46,18.89 23.33,18.89 18.63,23.59 18.63,23.97 17.62,24.98 17.62,25.75 17.24,26.13 17.24,31.33 18.13,32.22 18.13,34 VL10.X
  Bottom 0.254: v33.75,24.48 v35.91,26.63
X11  (via drill 0.3)
  Top 0.254: v37.81,37.81 R16.2 | v37.81,35.02 37.81,35.27 38.06,35.52 38.06,36.16 U2.8 | v34.51,35.02 32.6,35.02 30.19,32.6 24.73,32.6 22.32,35.02 22.32,41.24 19.9,43.65 VL11.X
  Bottom 0.254: v37.81,37.81 v37.81,35.02 v34.51,35.02
X12  (via drill 0.3)
  Top 0.254: R17.2 39.08,37.3 38.89,37.11 | 38.89,37.11 38.83,37.05 38.83,36.29 U2.7 | v33.62,36.67 34.25,37.3 38.45,37.3 38.57,37.18 38.83,37.18 38.89,37.11
  Bottom 0.254: v33.62,36.67 32.6,36.67 28.54,40.73 28.54,47.46 26.63,49.37 VL12.X

### Text on the board
tPlace: #1 | #12 | #2 | #11 | #3 | #10 | #4 | #9 | #5 | #8 | #6 | #7
bPlace: #1 | #12 | #2 | #11 | #3 | #10 | #4 | #9 | #5 | BATT | GND | RX | TX | LED | #8 | #6 | #7 | Blend NITGC | Supported by JLCPCB